# EAGLE schematic HFT-ArduinoShield-Module_1V0 (EAGLE 7.7.0)
Assembly variants: BAT-Charger_by_MCU

## Sheet 1 of 4: Arduino Uno socket
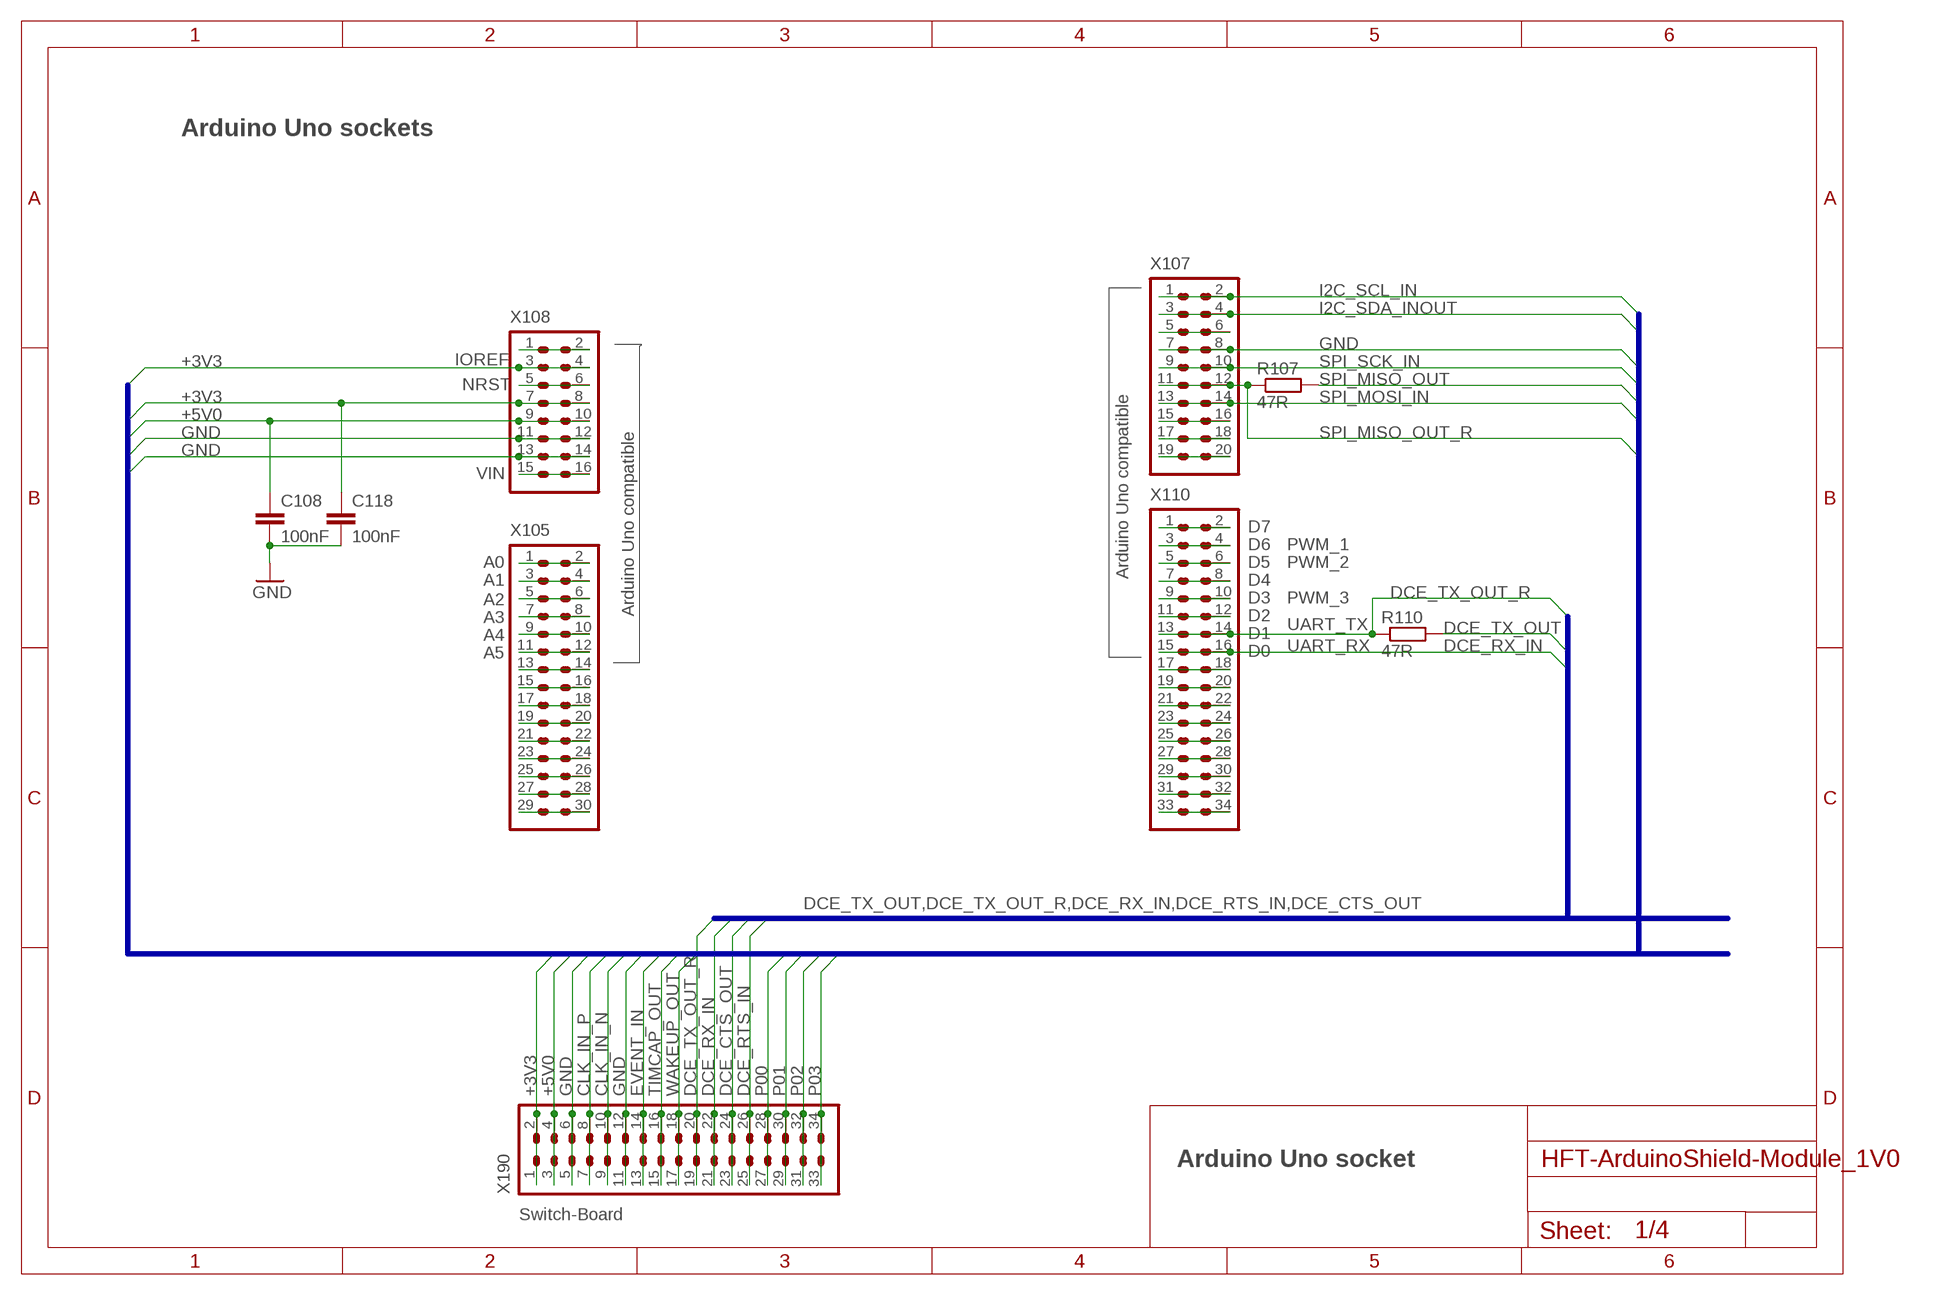
[diagram p0: schematic, sheet 1]

### Parts
C108  100nF  C-EUC0603  [C0603]
C118  100nF  C-EUC0603  [C0603]
R107  47R  R-EU_R0603  [R0603]
R110  47R  R-EU_R0603  [R0603]
X105  2X15_2MM56_SOCKET  [2X15]
X107  2X10_2MM56_SOCKET  [2X10]
X108  2X08_2MM56_SOCKET  [2X08]
X110  2X17_2MM56_SOCKET  [2X17]
X190  2X17_2MM56_SOCKET  [2X17]

### Nets
+3V3 [power]: C118.1 X108.3 X108.4 X108.7 X108.8 X190.1 X190.2 ; also sheet 2,3
+5V0 [power]: C108.1 X108.9 X108.10 X190.3 X190.4 ; also sheet 2,3
CLK_IN_N [bus]: X190.9 X190.10 ; also sheet 2,3
CLK_IN_P [bus]: X190.7 X190.8 ; also sheet 2,3
DCE_CTS_OUT: X190.23 X190.24 ; also sheet 3
DCE_RTS_IN: X190.25 X190.26 ; also sheet 3
DCE_RX_IN: X110.15 X110.16 X190.21 X190.22 ; also sheet 2,3
DCE_TX_OUT: R110.2 ; also sheet 3
DCE_TX_OUT_R: R110.1 X110.13 X110.14 X190.19 X190.20 ; also sheet 2
EVENT_IN: X190.13 X190.14 ; also sheet 3
GND: C108.2 C118.2 X107.7 X107.8 X108.11 X108.12 X108.13 X108.14 X190.5 X190.6 X190.11 X190.12 ; also sheet 2,3,4
I2C_SCL_IN: X107.1 X107.2 ; also sheet 2,3
I2C_SDA_INOUT: X107.3 X107.4 ; also sheet 2,3
N105_01: X105.1 X105.2
N105_03: X105.3 X105.4
N105_05: X105.5 X105.6
N105_07: X105.7 X105.8
N105_09: X105.9 X105.10
N105_11: X105.11 X105.12
N105_13: X105.13 X105.14
N105_15: X105.15 X105.16
N105_17: X105.17 X105.18
N105_19: X105.19 X105.20
N105_21: X105.21 X105.22
N105_23: X105.23 X105.24
N105_25: X105.25 X105.26
N105_27: X105.27 X105.28
N105_29: X105.29 X105.30
N107_05: X107.5 X107.6
N107_15: X107.15 X107.16
N107_17: X107.17 X107.18
N107_19: X107.19 X107.20
N108_01: X108.1 X108.2
N108_05: X108.5 X108.6
N108_15: X108.15 X108.16
N110_01: X110.1 X110.2
N110_03: X110.3 X110.4
N110_05: X110.5 X110.6
N110_07: X110.7 X110.8
N110_09: X110.9 X110.10
N110_11: X110.11 X110.12
N110_17: X110.17 X110.18
N110_19: X110.19 X110.20
N110_21: X110.21 X110.22
N110_23: X110.23 X110.24
N110_25: X110.25 X110.26
N110_27: X110.27 X110.28
N110_29: X110.29 X110.30
N110_31: X110.31 X110.32
N110_33: X110.33 X110.34
P00: X190.27 X190.28 ; also sheet 2,3
P01: X190.29 X190.30 ; also sheet 2,3
P02: X190.31 X190.32 ; also sheet 2,3
P03: X190.33 X190.34 ; also sheet 2,3
SPI_MISO_OUT: R107.2 ; also sheet 3
SPI_MISO_OUT_R: R107.1 X107.11 X107.12 ; also sheet 2
SPI_MOSI_IN: X107.13 X107.14 ; also sheet 2,3
SPI_SCK_IN: X107.9 X107.10 ; also sheet 2,3
TIMCAP_OUT: X190.15 X190.16 ; also sheet 3
WAKEUP_OUT: X190.17 X190.18 ; also sheet 3

### Buses
GND,+3V3,+5V0,CLK_IN_P,CLK_IN_N,EVENT_IN,WAKEUP_OUT,TIMCAP_OUT,I2C_SCL_IN,I2C_SDA_INOUT,SPI_SCK_IN,SPI_MOSI_IN,SPI_MISO_OUT,SPI_MISO_OUT_R,I2S_A_SCK_IN,I2S_A_SD_IN,I2S_A_MCLK_IN,I2S_A_FS_IN,I2S_B_SCK_OUT,I2S_B_SD_OUT,I2S_B_FS_OUT,P00,P01,P02,P03
DCE_TX_OUT,DCE_TX_OUT_R,DCE_RX_IN,DCE_RTS_IN,DCE_CTS_OUT

### Notes on the sheet
- Arduino Uno sockets
- IOREF
- NRST
- VIN
- D7
- D6 | PWM_1
- A0 | D5 | PWM_2
- Arduino Uno compatible
- A1 | D4
- A2 | D3 | PWM_3
- Arduino Uno compatible
- A3 | D2
- UART_TX
- A4 | D1
- UART_RX
- A5 | D0
- Arduino Uno socket
- Switch-Board

## Sheet 2 of 4: Raspberry Pi connector
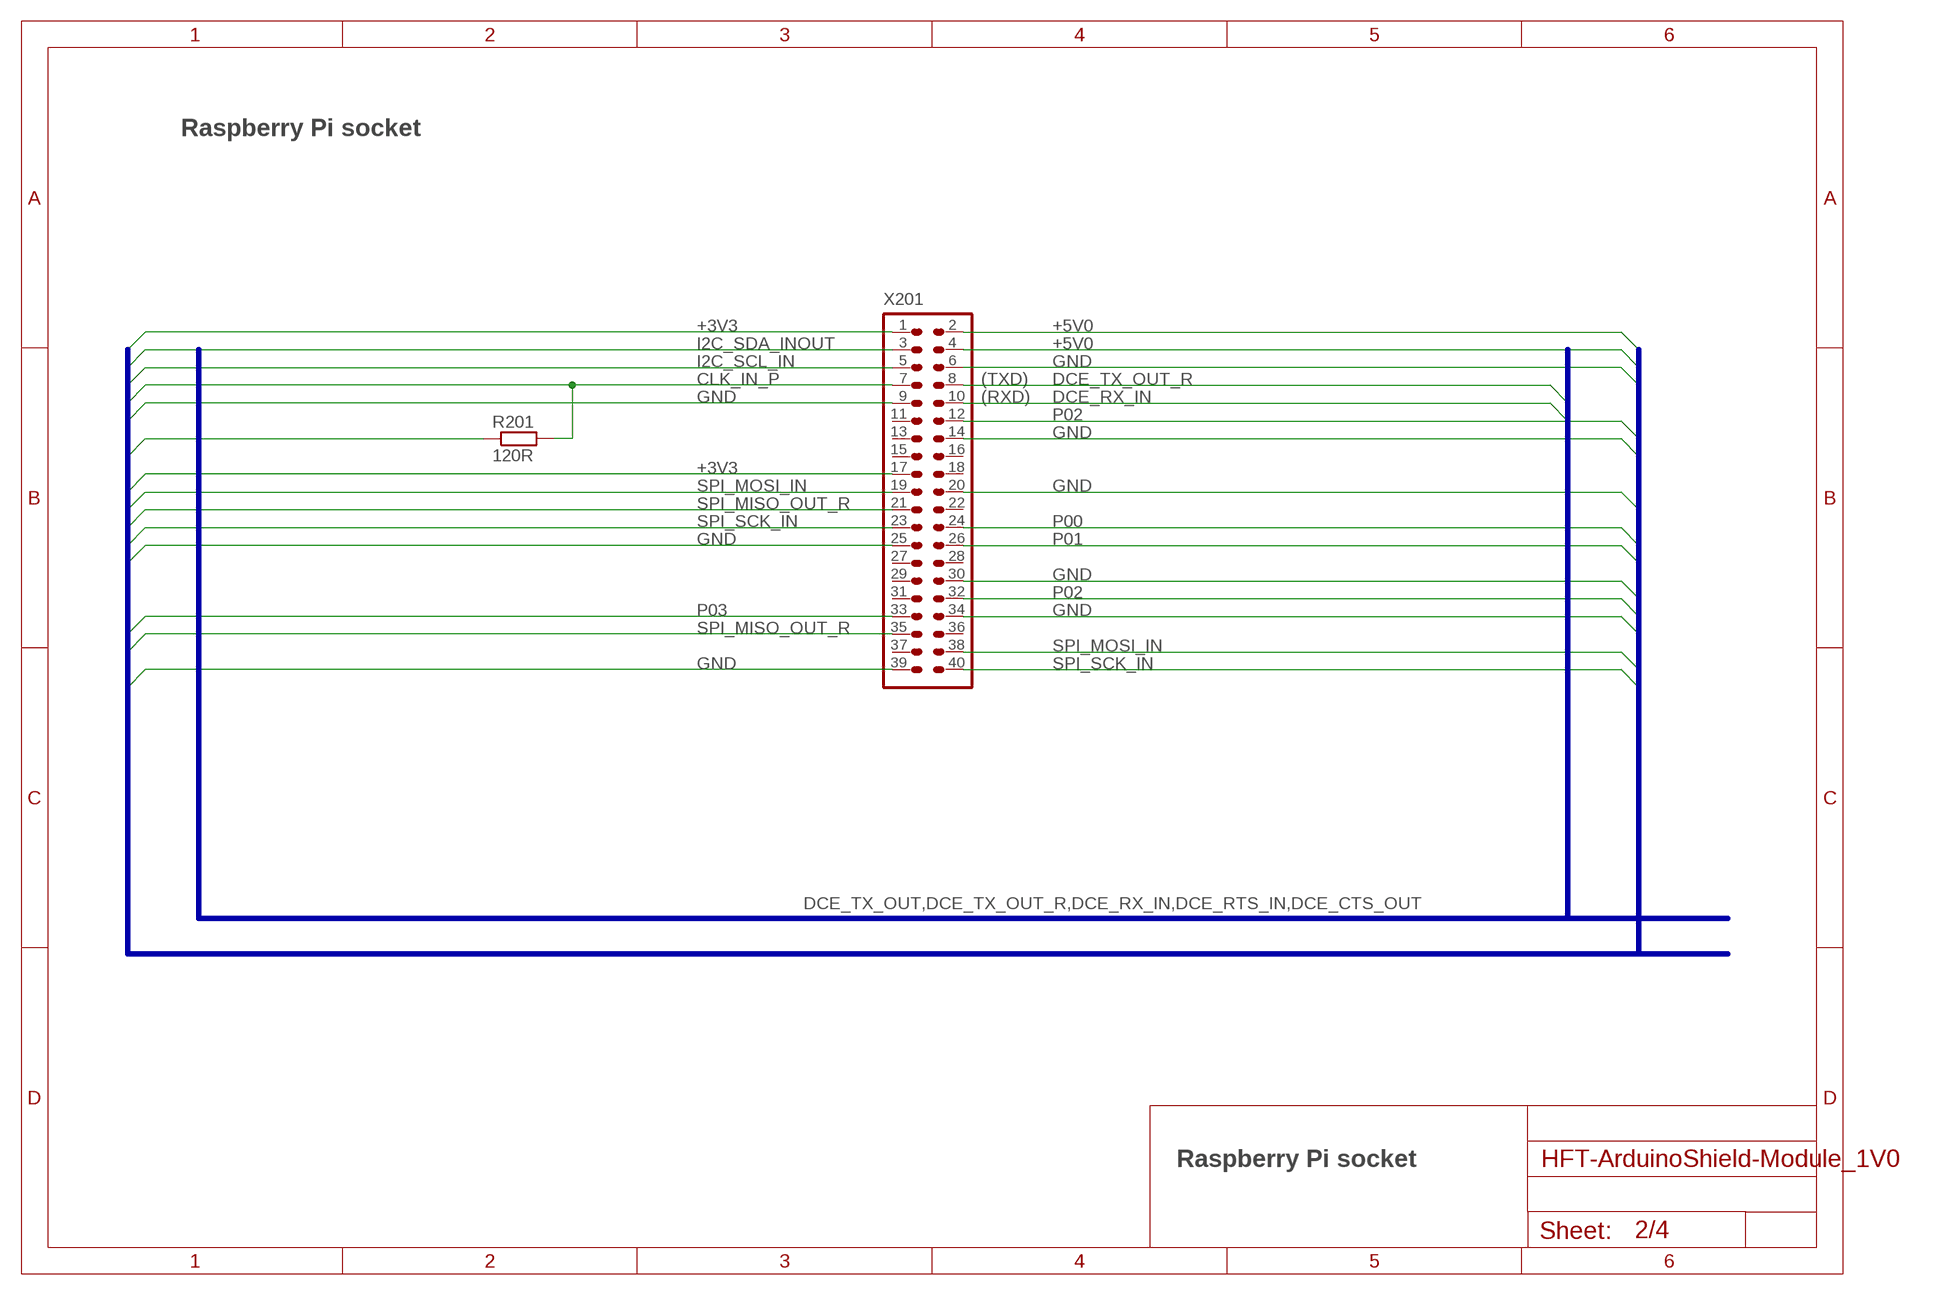
[diagram p1: schematic, sheet 2]

### Parts
R201  120R  R-EU_R0603  [R0603]
X201  2X20_2MM56_SOCKET  [2X20]

### Nets
+3V3 [power]: X201.1 X201.17 ; also sheet 1,3
+5V0 [power]: X201.2 X201.4 ; also sheet 1,3
CLK_IN_N [bus]: R201.1 ; also sheet 1,3
CLK_IN_P [bus]: R201.2 X201.7 ; also sheet 1,3
DCE_RX_IN: X201.10 ; also sheet 1,3
DCE_TX_OUT_R: X201.8 ; also sheet 1
GND: X201.6 X201.9 X201.14 X201.20 X201.25 X201.30 X201.34 X201.39 ; also sheet 1,3,4
I2C_SCL_IN: X201.5 ; also sheet 1,3
I2C_SDA_INOUT: X201.3 ; also sheet 1,3
P00: X201.24 ; also sheet 1,3
P01: X201.26 ; also sheet 1,3
P02: X201.12 X201.32 ; also sheet 1,3
P03: X201.33 ; also sheet 1,3
SPI_MISO_OUT_R: X201.21 X201.35 ; also sheet 1
SPI_MOSI_IN: X201.19 X201.38 ; also sheet 1,3
SPI_SCK_IN: X201.23 X201.40 ; also sheet 1,3
Unconnected: X201.11 X201.13 X201.15 X201.16 X201.18 X201.22 X201.27 X201.28 X201.29 X201.31 X201.36 X201.37

### Buses
GND,+3V3,+5V0,CLK_IN_P,CLK_IN_N,EVENT_IN,WAKEUP_OUT,TIMCAP_OUT,I2C_SCL_IN,I2C_SDA_INOUT,SPI_SCK_IN,SPI_MOSI_IN,SPI_MISO_OUT,SPI_MISO_OUT_R,I2S_A_SCK_IN,I2S_A_SD_IN,I2S_A_MCLK_IN,I2S_A_FS_IN,I2S_B_SCK_OUT,I2S_B_SD_OUT,I2S_B_FS_OUT,P00,P01,P02,P03
DCE_TX_OUT,DCE_TX_OUT_R,DCE_RX_IN,DCE_RTS_IN,DCE_CTS_OUT

### Notes on the sheet
- Raspberry Pi socket
- (TXD)
- (RXD)
- Raspberry Pi socket

## Sheet 3 of 4: Connectors
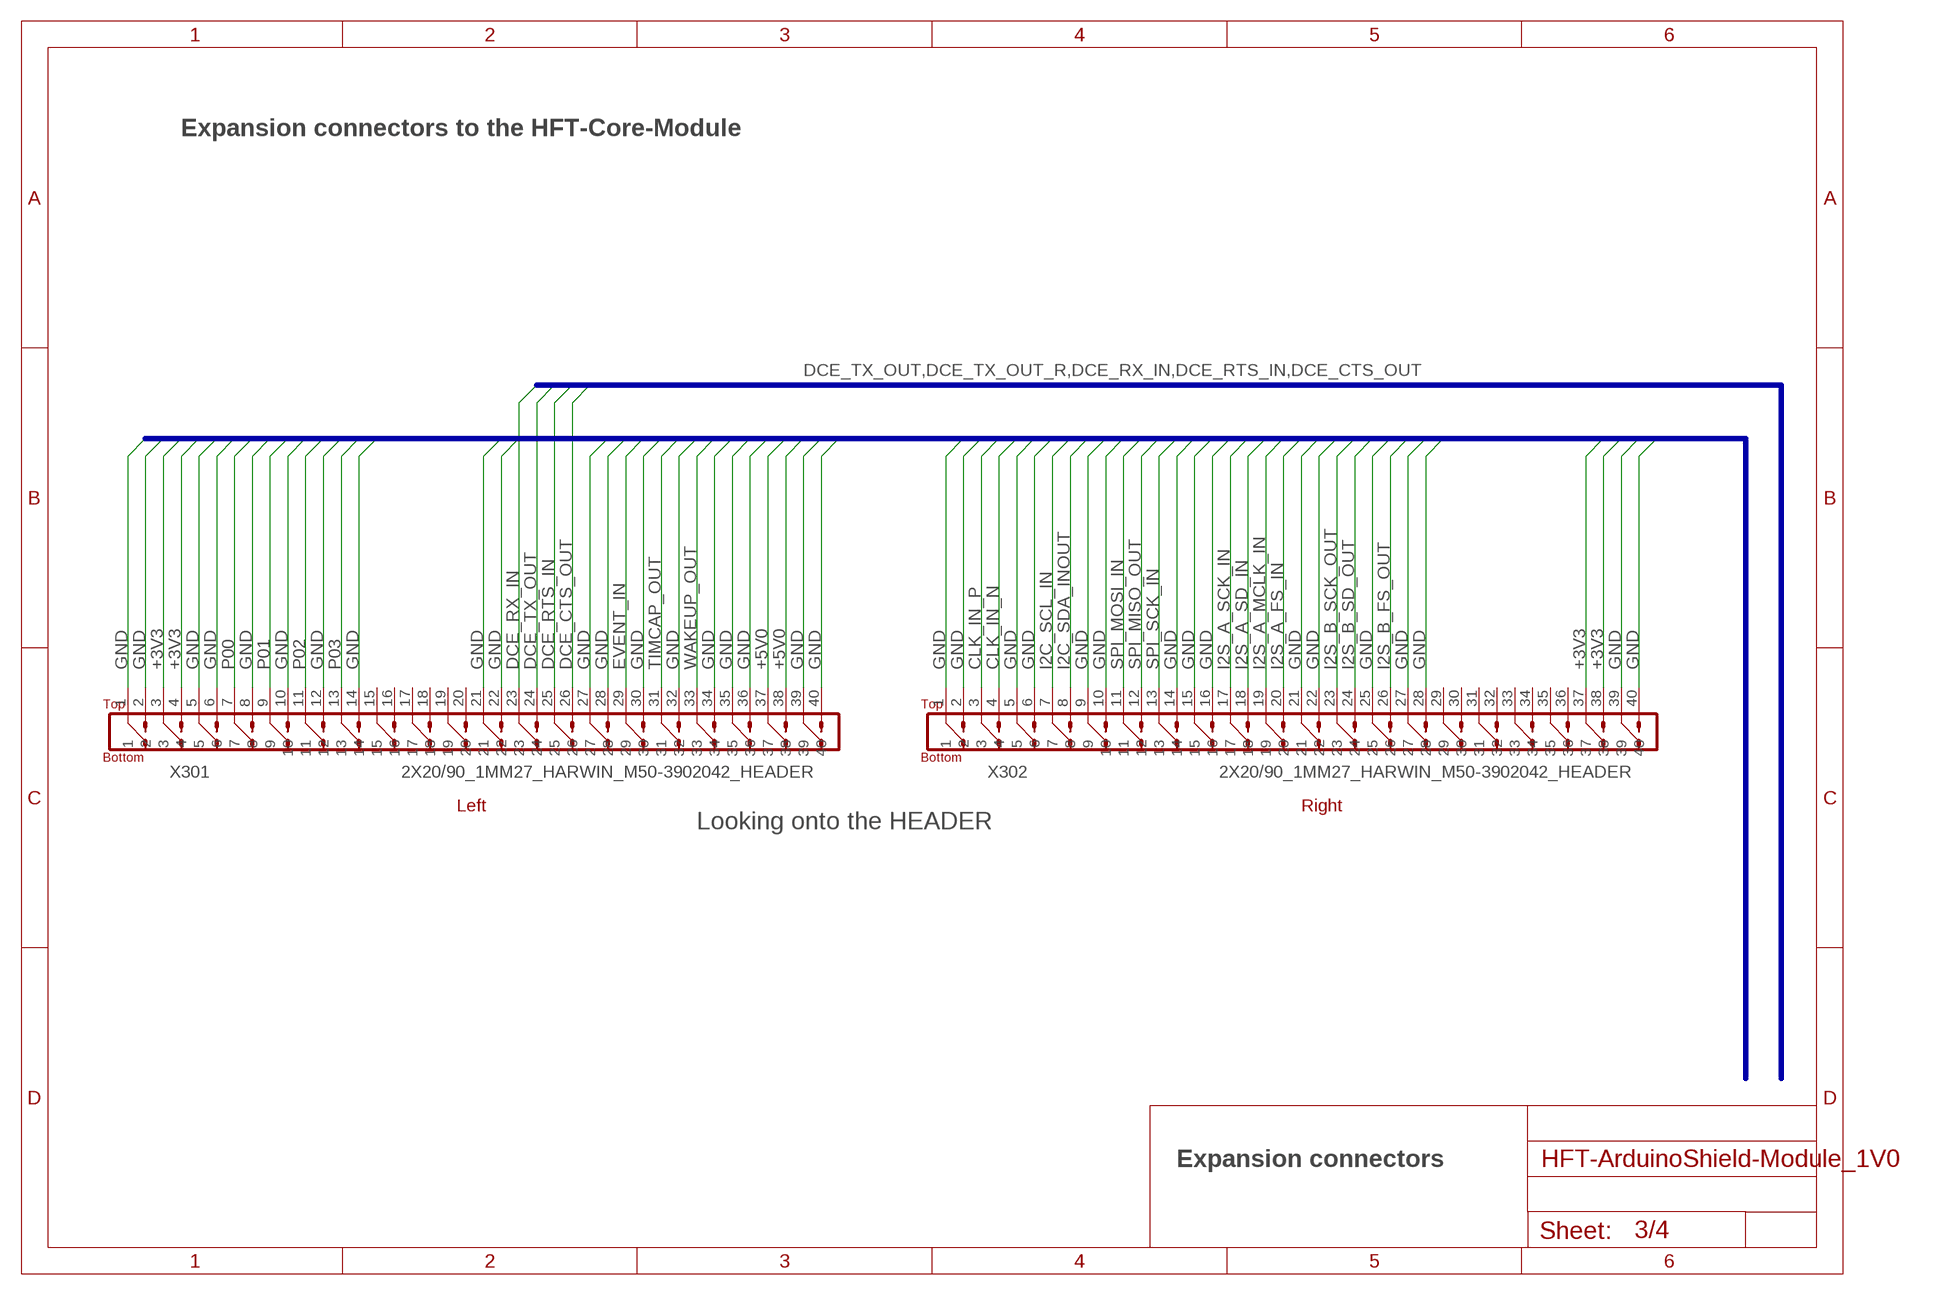
[diagram p2: schematic, sheet 3]

### Parts
X301  2X20/90_1MM27_HARWIN_M50-3902042_HEADER  [2X20/90_1MM27_HARWIN_M50-3902042_HEADER]
X302  2X20/90_1MM27_HARWIN_M50-3902042_HEADER  [2X20/90_1MM27_HARWIN_M50-3902042_HEADER]

### Nets
+3V3 [power]: X301.3 X301.4 X302.37 X302.38 ; also sheet 1,2
+5V0 [power]: X301.37 X301.38 ; also sheet 1,2
CLK_IN_N [bus]: X302.4 ; also sheet 1,2
CLK_IN_P [bus]: X302.3 ; also sheet 1,2
DCE_CTS_OUT: X301.26 ; also sheet 1
DCE_RTS_IN: X301.25 ; also sheet 1
DCE_RX_IN: X301.23 ; also sheet 1,2
DCE_TX_OUT: X301.24 ; also sheet 1
EVENT_IN: X301.29 ; also sheet 1
GND: X301.1 X301.2 X301.5 X301.6 X301.8 X301.10 X301.12 X301.14 X301.21 X301.22 X301.27 X301.28 X301.30 X301.32 X301.34 X301.35 X301.36 X301.39 X301.40 X302.1 X302.2 X302.5 X302.6 X302.9 X302.10 X302.14 X302.15 X302.16 X302.21 X302.22 X302.25 X302.27 X302.28 X302.39 X302.40 ; also sheet 1,2,4
I2C_SCL_IN: X302.7 ; also sheet 1,2
I2C_SDA_INOUT: X302.8 ; also sheet 1,2
I2S_A_FS_IN: X302.20
I2S_A_MCLK_IN: X302.19
I2S_A_SCK_IN: X302.17
I2S_A_SD_IN: X302.18
I2S_B_FS_OUT: X302.26
I2S_B_SCK_OUT: X302.23
I2S_B_SD_OUT: X302.24
P00: X301.7 ; also sheet 1,2
P01: X301.9 ; also sheet 1,2
P02: X301.11 ; also sheet 1,2
P03: X301.13 ; also sheet 1,2
SPI_MISO_OUT: X302.12 ; also sheet 1
SPI_MOSI_IN: X302.11 ; also sheet 1,2
SPI_SCK_IN: X302.13 ; also sheet 1,2
TIMCAP_OUT: X301.31 ; also sheet 1
WAKEUP_OUT: X301.33 ; also sheet 1
Unconnected: X301.15 X301.16 X301.17 X301.18 X301.19 X301.20 X302.29 X302.30 X302.31 X302.32 X302.33 X302.34 X302.35 X302.36

### Buses
GND,+3V3,+5V0,CLK_IN_P,CLK_IN_N,EVENT_IN,WAKEUP_OUT,TIMCAP_OUT,I2C_SCL_IN,I2C_SDA_INOUT,SPI_SCK_IN,SPI_MOSI_IN,SPI_MISO_OUT,SPI_MISO_OUT_R,I2S_A_SCK_IN,I2S_A_SD_IN,I2S_A_MCLK_IN,I2S_A_FS_IN,I2S_B_SCK_OUT,I2S_B_SD_OUT,I2S_B_FS_OUT,P00,P01,P02,P03
DCE_TX_OUT,DCE_TX_OUT_R,DCE_RX_IN,DCE_RTS_IN,DCE_CTS_OUT

### Notes on the sheet
- Expansion connectors to the HFT-Core-Module
- Left | Right
- Looking onto the HEADER
- Expansion connectors

## Sheet 4 of 4: Holes
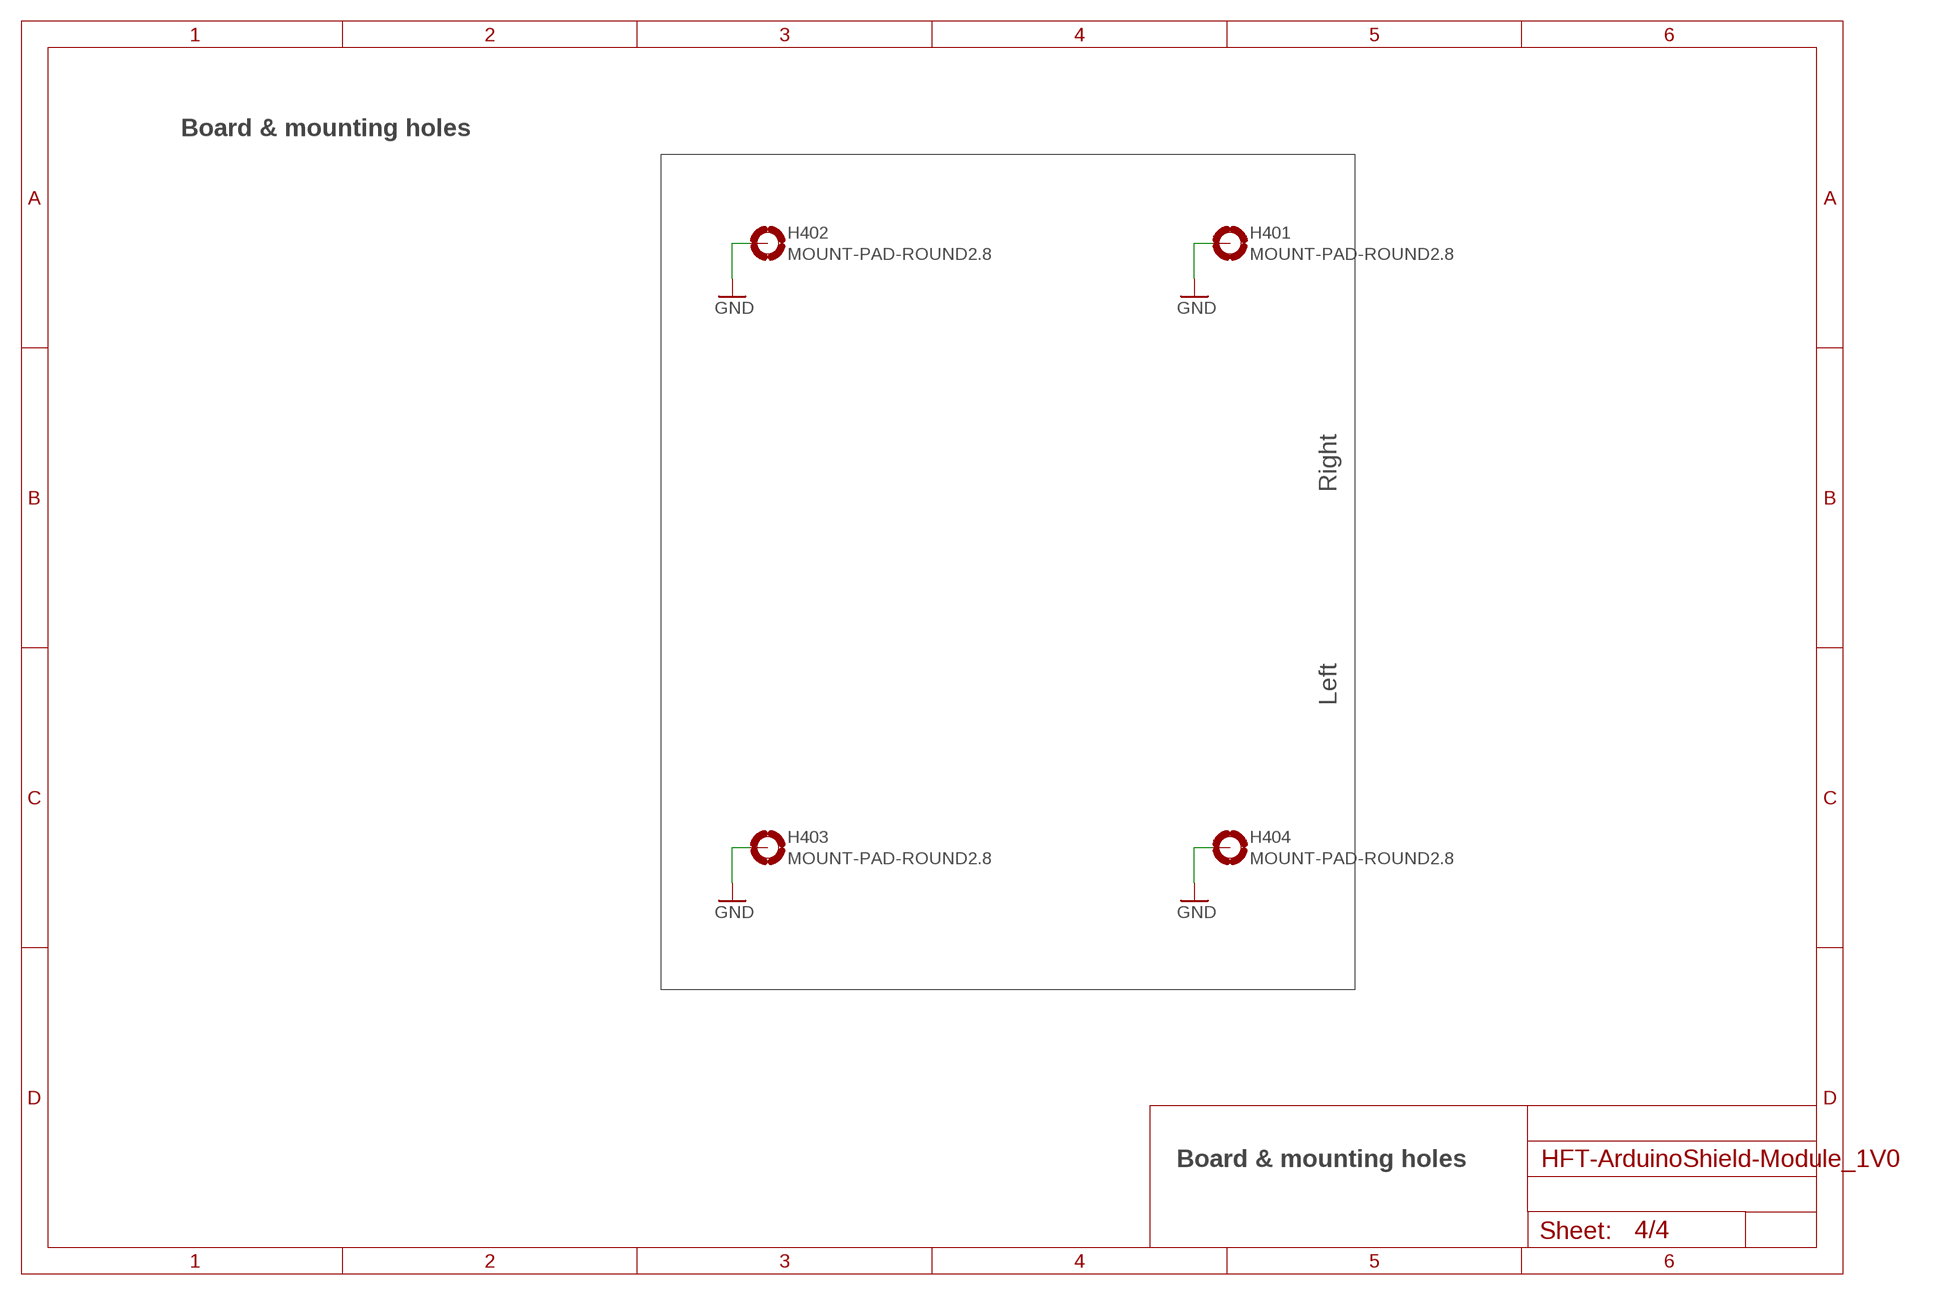
[diagram p3: schematic, sheet 4]

### Parts
H401  MOUNT-PAD-ROUND2.8  [2,8-PAD]
H402  MOUNT-PAD-ROUND2.8  [2,8-PAD]
H403  MOUNT-PAD-ROUND2.8  [2,8-PAD]
H404  MOUNT-PAD-ROUND2.8  [2,8-PAD]

### Nets
GND: H401.B2,8(MOUNT) H402.B2,8(MOUNT) H403.B2,8(MOUNT) H404.B2,8(MOUNT) ; also sheet 1,2,3

### Notes on the sheet
- Board & mounting holes
- Right
- Left
- Board & mounting holes

## Library data of the parts
C108 C118 = df4iah_rcl:C-EU: CAPACITOR, European symbol
H401-H404 = holes:MOUNT-PAD-ROUND: MOUNTING PAD, round
R107 R110 R201 = df4iah_rcl:R-EU_: RESISTOR, European symbol
X105 = df4iah_connector:2X15_2MM56_SOCKET: Header 2X15 2.54mm
X107 = df4iah_connector:2X10_2MM56_SOCKET: Header 2X10 2.54mm
X108 = df4iah_connector:2X08_2MM56_SOCKET: Header 2X08 2.54mm
X110 X190 = df4iah_connector:2X17_2MM56_SOCKET: Header 2X17 2.54mm
X201 = df4iah_connector:2X20_2MM56_SOCKET: Header 2X20 2.54mm
X301 X302 = df4iah_connector:2X20/90_1MM27_HARWIN_M50-3902042_HEADER: Header 20X2 1.27mm M50-3902042 Archer, 90°

## Net classes
1 power: width 0.5 mm
2 bus: clearance 0.6 mm